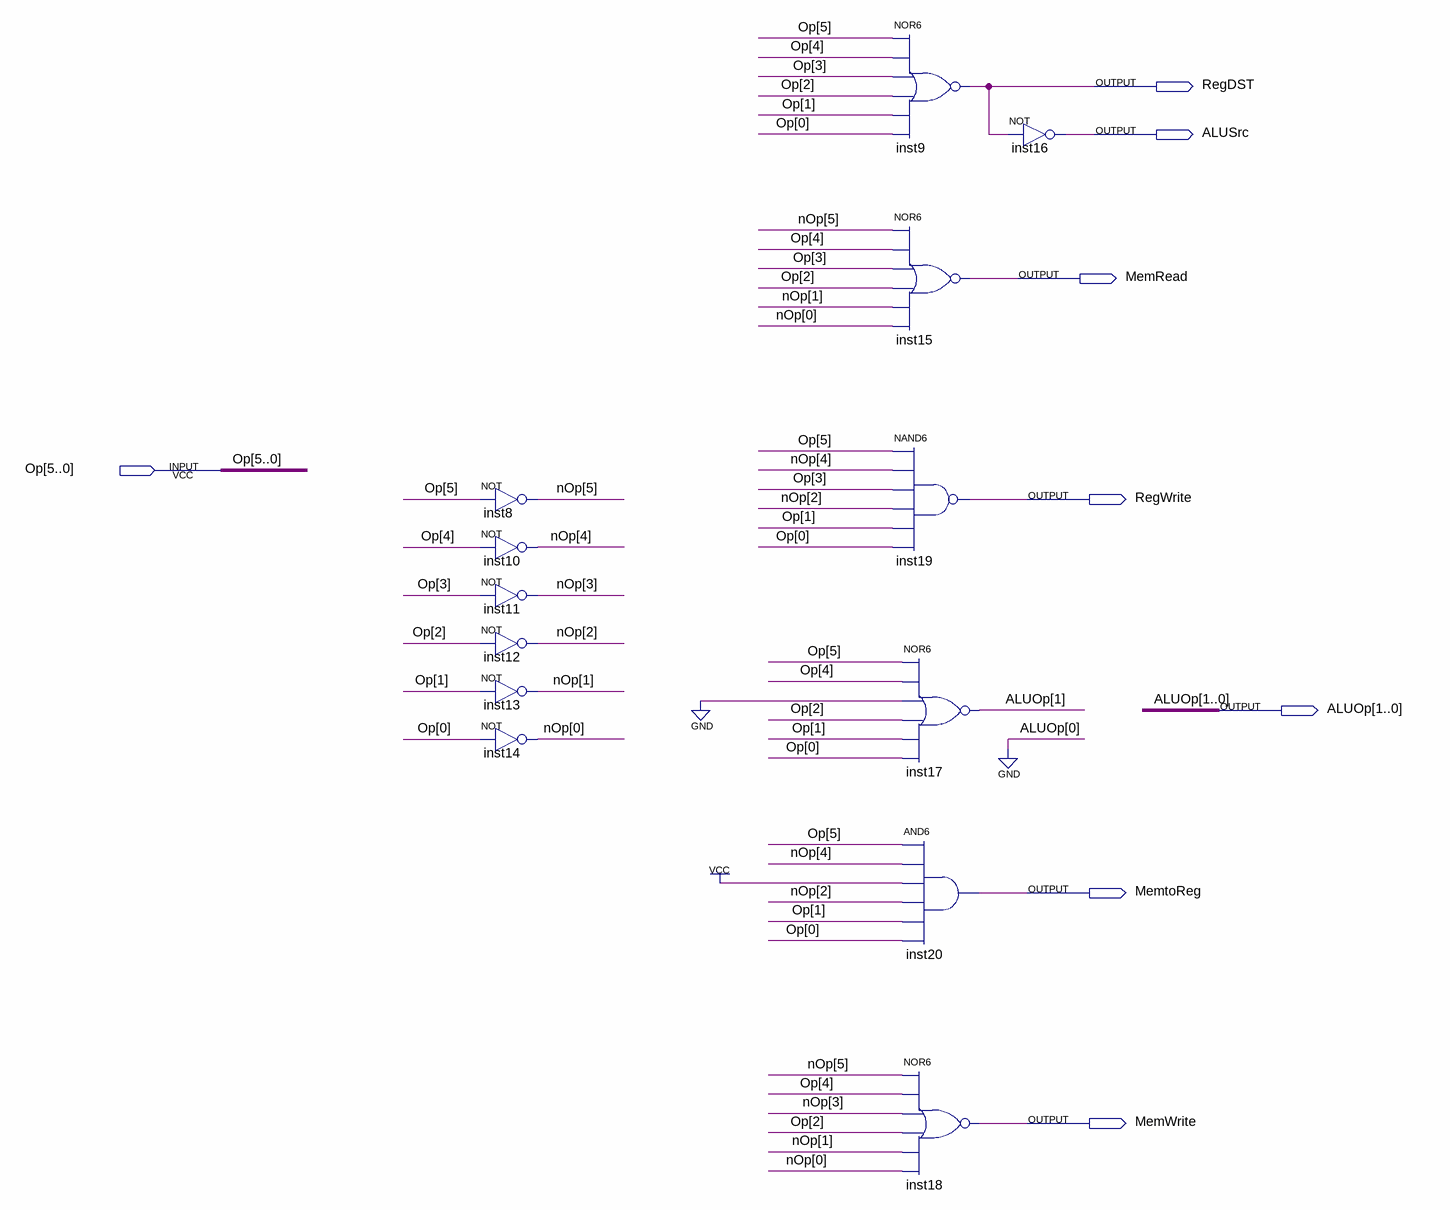
[diagram p0: schematic sheet]
// Quartus schematic Control.bdf as structural Verilog: 13 symbols, 8 pins
module Control (
  input  [5:0] Op,
  output RegDST,
  output ALUSrc,
  output MemRead,
  output RegWrite,
  output [1:0] ALUOp,
  output MemtoReg,
  output MemWrite
);

  wire [5:0] nOp;

  not inst8 (nOp[5], Op[5]);
  not inst10 (nOp[4], Op[4]);
  not inst11 (nOp[3], Op[3]);
  not inst12 (nOp[2], Op[2]);
  not inst13 (nOp[1], Op[1]);
  not inst14 (nOp[0], Op[0]);
  nor inst9 (RegDST, Op[5], Op[4], Op[3], Op[2], Op[1], Op[0]);
  nor inst15 (MemRead, nOp[5], Op[4], Op[3], Op[2], nOp[1], nOp[0]);
  nand inst19 (RegWrite, Op[5], nOp[4], Op[3], nOp[2], Op[1], Op[0]);
  nor inst17 (ALUOp[1], Op[5], Op[4], 1'b0, Op[2], Op[1], Op[0]);
  and inst20 (MemtoReg, Op[5], nOp[4], 1'b1, nOp[2], Op[1], Op[0]);
  nor inst18 (MemWrite, nOp[5], Op[4], nOp[3], Op[2], nOp[1], nOp[0]);
  not inst16 (ALUSrc, RegDST);

  assign ALUOp[0] = 1'b0;
endmodule
